# Altium schematic sheet QuarkNPi-Bata0.2-220731.schdoc
size 567 x 407 mm
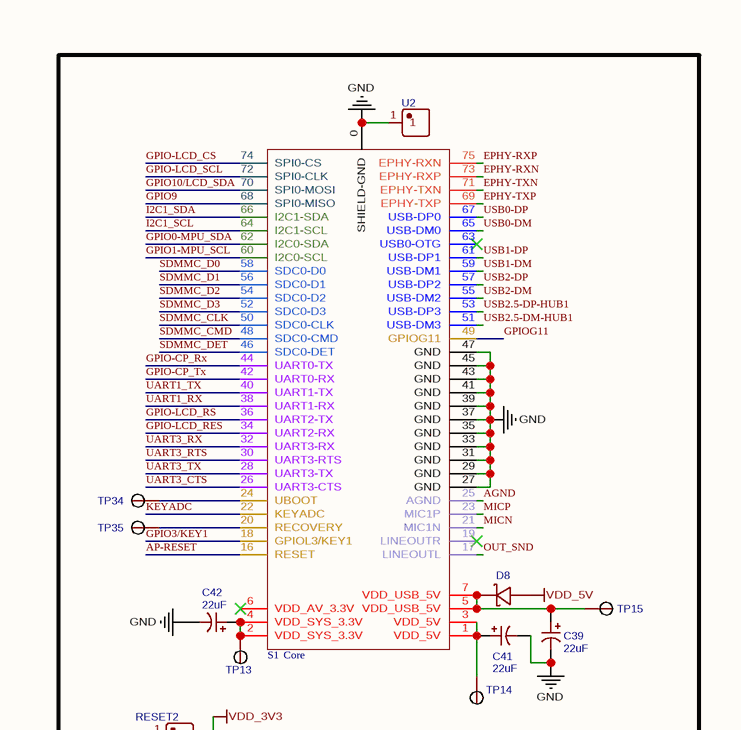
[diagram p0: QuarkNPi-Bata0.2-220731.schdoc, top left]
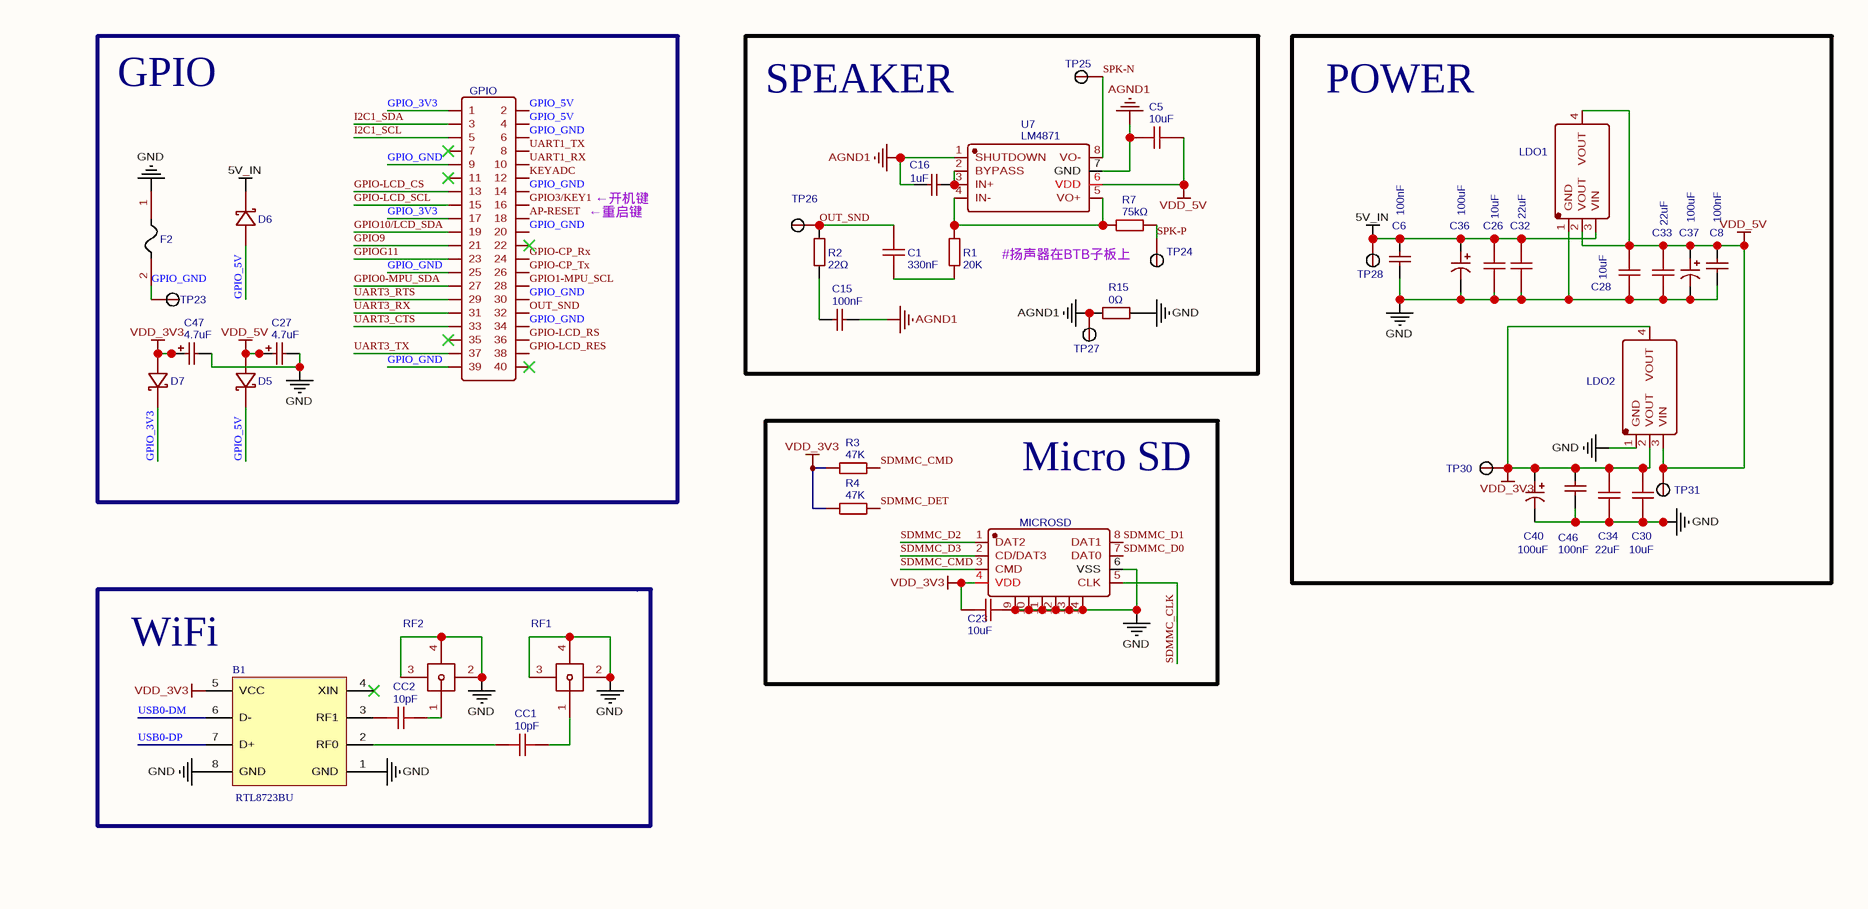
[diagram p1: QuarkNPi-Bata0.2-220731.schdoc, top right]
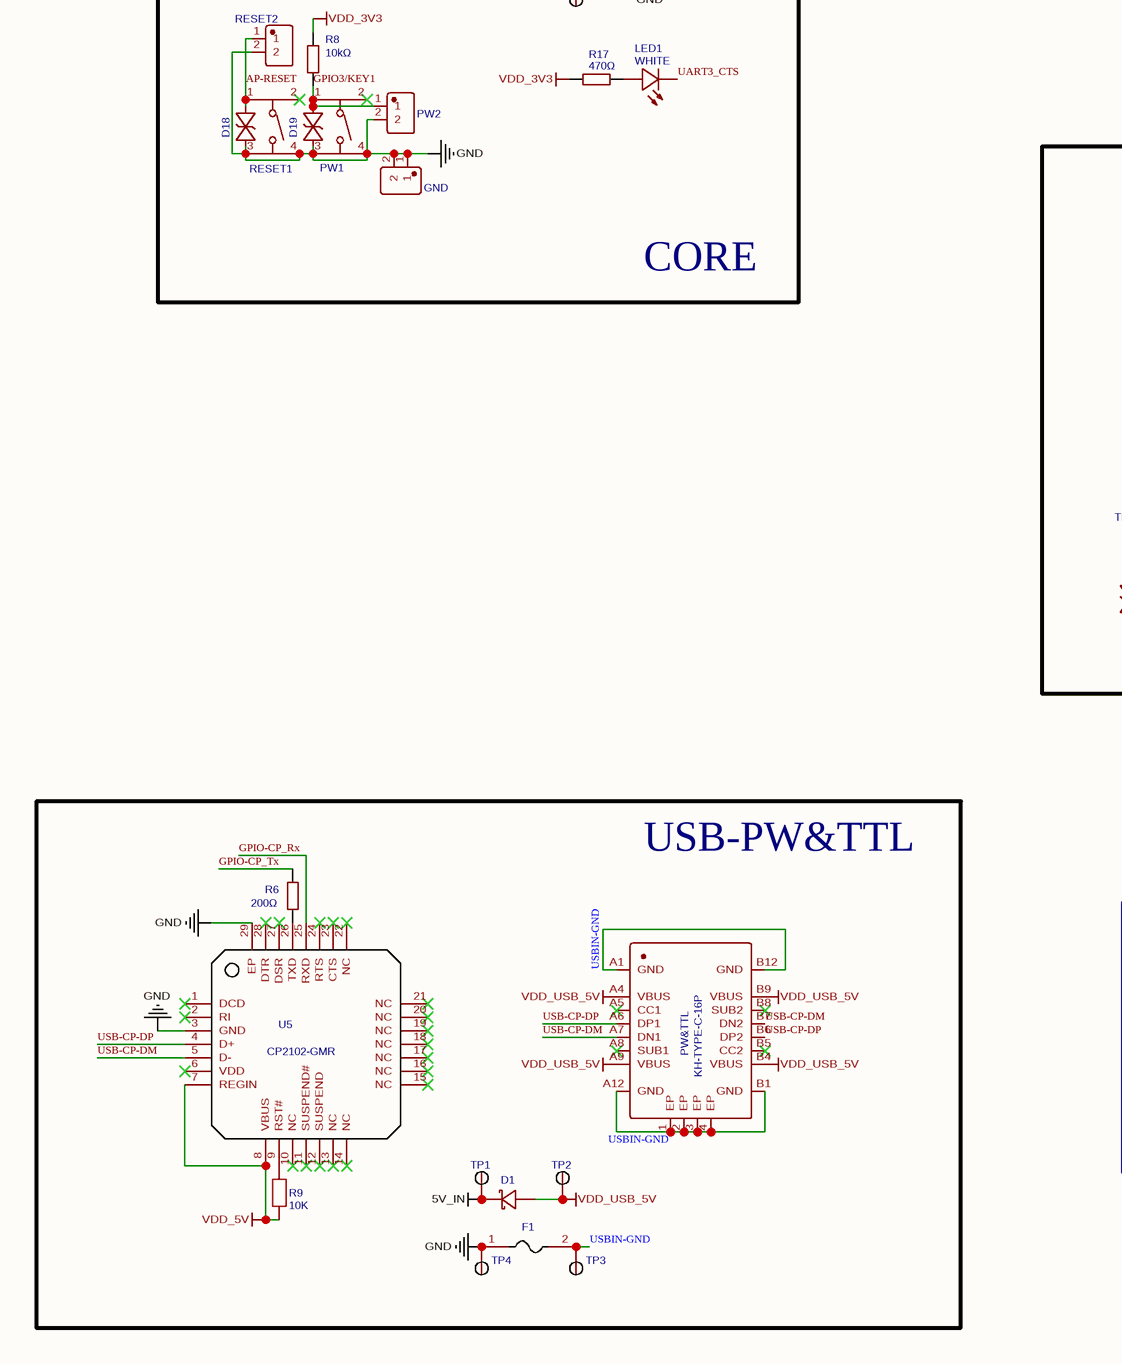
[diagram p2: QuarkNPi-Bata0.2-220731.schdoc, bottom left]
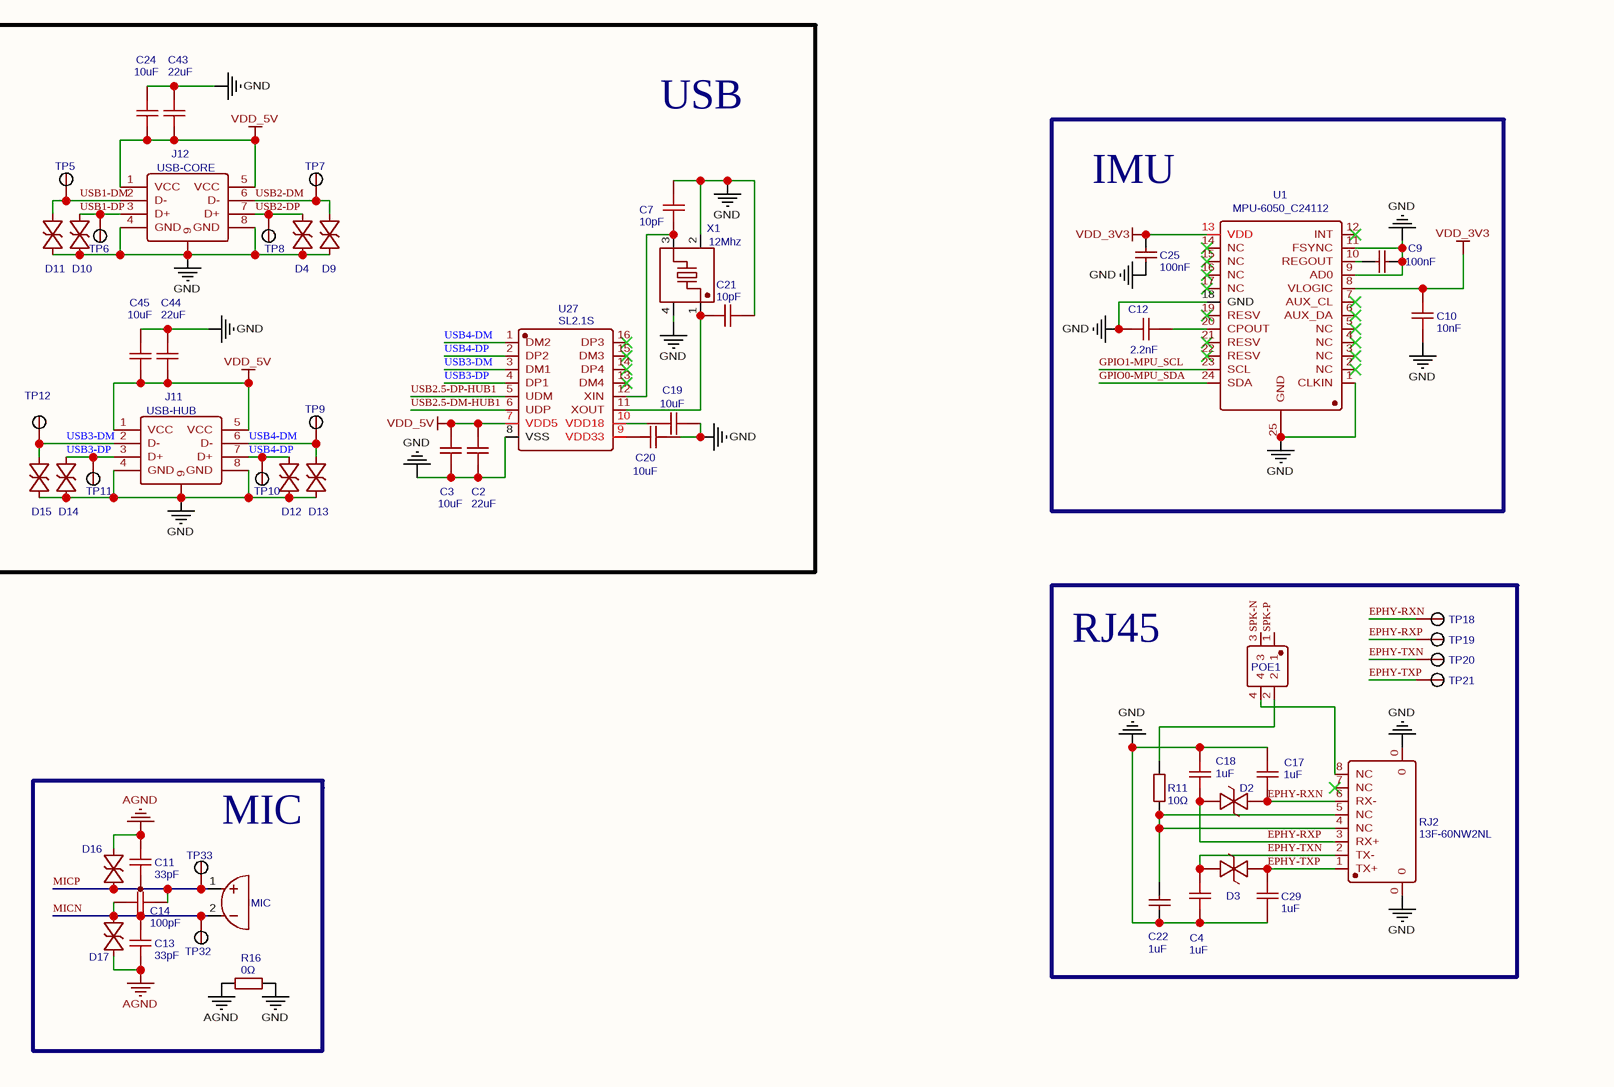
[diagram p3: QuarkNPi-Bata0.2-220731.schdoc, bottom right]

## Parts
B1  RTL8723BU  [USB-WIFI-BT-RTL8723BU]
C1  330nF  [C0402]
C2  22uF  [C0402]
C3  10uF  [C0402]
C4  1uF  [C0201]
C5  10uF  [C0402]
C6  100nF  [C0402_NEW]
C7  10pF  [C0402]
C8  100nF  [C0402_NEW]
C9  100nF  [C0402_NEW]
C10  10nF  [C0402]
C11  33pF  [C0201]
C12  2.2nF  [C0402]
C13  33pF  [C0201]
C14  100pF  [C0201]
C15  100nF  [C0402]
C16  1uF  [C0402]
C17  1uF  [C0201]
C18  1uF  [C0201]
C19  10uF  [C0603]
C20  10uF  [C0603]
C21  10pF  [C0402]
C22  1uF  [C0603]
C23  10uF  [C0402]
C24  10uF  [C0402]
C25  100nF  [C0402_NEW]
C26  10uF  [C0402]
C27  4.7uF  [CAP-SMD_L3.2-W1.6]
C28  10uF  [C0402]
C29  1uF  [C0201]
C30  10uF  [C0402]
C32  22uF  [C0402]
C33  22uF  [C0402]
C34  22uF  [C0402]
C36  100uF  [CAP-SMD_L3.2-W2.8-FD]
C37  100uF  [CAP-SMD_L3.2-W2.8-FD]
C39  22uF  [CAP-SMD_L2.0-W1.3-FD]
C40  100uF  [CAP-SMD_L3.2-W2.8-FD]
C41  22uF  [CAP-SMD_L2.0-W1.3-FD]
C42  22uF  [CAP-SMD_L2.0-W1.3-FD]
C43  22uF  [C0402]
C44  22uF  [C0402]
C45  10uF  [C0402]
C46  100nF  [C0402_NEW]
C47  4.7uF  [CAP-SMD_L3.2-W1.6]
CC1  10pF  [C0201]
CC2  10pF  [C0201]
D1  SS510G  [SMA_L4.4-W2.8-LS5.4-RD]  (value not drawn)
D2  EGA10201V05A0  [D0201-BI]  (value not drawn)
D3  EGA10201V05A0  [D0201-BI]  (value not drawn)
D4  ESD5451N-TP  [D0402-BI]  (value not drawn)
D5  SS510G  [SMA_L4.4-W2.8-LS5.4-RD]  (value not drawn)
D6  SS510G  [SMA_L4.4-W2.8-LS5.4-RD]  (value not drawn)
D7  SS510G  [SMA_L4.4-W2.8-LS5.4-RD]  (value not drawn)
D8  PMEG4030ER,115  [SOD-123_L2.6-W1.7-LS3.5-RD]  (value not drawn)
D9  ESD5451N-TP  [D0402-BI]  (value not drawn)
D10  ESD5451N-TP  [D0402-BI]  (value not drawn)
D11  ESD5451N-TP  [D0402-BI]  (value not drawn)
D12  ESD5451N-TP  [D0402-BI]  (value not drawn)
D13  ESD5451N-TP  [D0402-BI]  (value not drawn)
D14  ESD5451N-TP  [D0402-BI]  (value not drawn)
D15  ESD5451N-TP  [D0402-BI]  (value not drawn)
D16  ESD5451N-TP  [D0402-BI]  (value not drawn)
D17  ESD5451N-TP  [D0402-BI]  (value not drawn)
D18  ESD5451N-TP  [D0402-BI]  (value not drawn)
D19  ESD5451N-TP  [D0402-BI]  (value not drawn)
F1  mSMD400  [F1812]  (value not drawn)
F2  mSMD400  [F1812]  (value not drawn)
GND  KH-2.54PH180-1X2P-L11.5  [HDR-TH_2P-P2.54-V-M]  (value not drawn)
GPIO  Header-Male-2.54_2x20  [HDR-TH_40P-P2.54-V-M-R2-C20-S2.54]  (value not drawn)
J11  USB-HUB  [USB-A-TH_U-USBAR04P-F201]
J12  USB-CORE  [USB-A-TH_U-USBAR04P-F201]
LDO1  1117-5v  [SOT-223_L6.5-W3.5-P2.30-LS7.0-BR]  (value not drawn)
LDO2  1117-3V3  [SOT-223_L6.5-W3.5-P2.30-LS7.0-BR]  (value not drawn)
LED1  WHITE  [LED0402-RD_YELLOW]
MIC  GMI4013S-2C54DB  [MIC-SMD_BD4.0_B4013AM423-008]  (value not drawn)
MICROSD  1040310811  [SIM-SMD_8P-1040310811]  (value not drawn)
POE1  210-72-02GB01  [HDR-TH_4P-P2.54-V-R2-C2-S2.54_A2541WV-2X2P]  (value not drawn)
PW1  ST-1188  [SW-SMD_4P-L4.2-W3.2-P2.15-LS5.2]  (value not drawn)
PW2  KH-2.54PH180-1X2P-L11.5  [HDR-TH_2P-P2.54-V-M]  (value not drawn)
PW&TTL  KH-TYPE-C-16P  [USB-C-SMD_KH-TYPE-C-16P]
R1  20K  [R0402]
R2  22Ω  [R0402]
R3  47K  [R0402]
R4  47K  [R0402]
R6  200Ω  [R0402]
R7  75kΩ  [R0402]
R8  10kΩ  [R0402]
R9  10K  [R0402]
R11  10Ω  [R1206]
R15  0Ω  [R0402]
R16  0Ω  [R0402]
R17  470Ω  [R0402]
RESET1  ST-1188  [SW-SMD_4P-L4.2-W3.2-P2.15-LS5.2]  (value not drawn)
RESET2  KH-2.54PH180-1X2P-L11.5  [HDR-TH_2P-P2.54-V-M]  (value not drawn)
RF1  HC-RF-IPEX0303-01  [IPEX-SMD_HC-RF-IPEX0303-01]  (value not drawn)
RF2  HC-RF-IPEX0303-01  [IPEX-SMD_HC-RF-IPEX0303-01]  (value not drawn)
RJ2  13F-60NW2NL  [RJ45-TH_8P-P2.54-S2.54_L21.6-W16.3-EH11.4]
S1  Core  [QUANTUM-QUARK-N]
TP1  TP测试点  [TP测试点]  (value not drawn)
TP2  TP测试点  [TP测试点]  (value not drawn)
TP3  TP测试点  [TP测试点]  (value not drawn)
TP4  TP测试点  [TP测试点]  (value not drawn)
TP5  TP测试点  [TP测试点]  (value not drawn)
TP6  TP测试点  [TP测试点]  (value not drawn)
TP7  TP测试点  [TP测试点]  (value not drawn)
TP8  TP测试点  [TP测试点]  (value not drawn)
TP9  TP测试点  [TP测试点]  (value not drawn)
TP10  TP测试点  [TP测试点]  (value not drawn)
TP11  TP测试点  [TP测试点]  (value not drawn)
TP12  TP测试点  [TP测试点]  (value not drawn)
TP13  TP测试点  [TP测试点]  (value not drawn)
TP14  TP测试点  [TP测试点]  (value not drawn)
TP15  TP测试点  [TP测试点]  (value not drawn)
TP18  TP测试点  [TP测试点]  (value not drawn)
TP19  TP测试点  [TP测试点]  (value not drawn)
TP20  TP测试点  [TP测试点]  (value not drawn)
TP21  TP测试点  [TP测试点]  (value not drawn)
TP23  TP测试点  [TP测试点]  (value not drawn)
TP24  TP测试点  [TP测试点]  (value not drawn)
TP25  TP测试点  [TP测试点]  (value not drawn)
TP26  TP测试点  [TP测试点]  (value not drawn)
TP27  TP测试点  [TP测试点]  (value not drawn)
TP28  TP测试点  [TP测试点]  (value not drawn)
TP30  TP测试点  [TP测试点]  (value not drawn)
TP31  TP测试点  [TP测试点]  (value not drawn)
TP32  TP测试点  [TP测试点]  (value not drawn)
TP33  TP测试点  [TP测试点]  (value not drawn)
TP34  TP测试点  [TP测试点]  (value not drawn)
TP35  TP测试点  [TP测试点]  (value not drawn)
U1  MPU-6050_C24112  [QFN-24_L4.0-W4.0-P0.50-BL-EP2.7]
U2  SMTWE2015MTJ  [M.2螺孔]  (value not drawn)
U5  CP2102-GMR  [WQFN-28_L5.0-W5.0-P0.50-BL-EP3.2]
U7  LM4871  [SOP-8_L4.9-W3.9-P1.27-LS6.0-BL]
U27  SL2.1S  [SSOP-16_L4.6-W2.6-P0.53-LS4.0-BL]
X1  12Mhz  [OSC-SMD_4P-L2.5-W2.0-BL]

## Blocks framed on the sheet
GPIO: C27 C47 D5-D7 F2 GPIO TP23
SPEAKER: C1 C5 C15 C16 R1 R2 R7 R15 TP24-TP27 U7
POWER: C6 C8 C26 C28 C30 C32-C34 C36 C37 C40 C46 LDO1 LDO2 TP28 TP30 TP31
CORE: C39 C41 C42 D8 D18 D19 GND LED1 PW1 PW2 R8 R17 RESET1 RESET2 S1 TP13-TP15 TP34 TP35 U2
Micro SD: C23 MICROSD R3 R4
USB: C2 C3 C7 C19-C21 C24 C43-C45 D4 D9-D15 J11 J12 TP5-TP12 U27 X1
IMU: C9 C10 C12 C25 U1
RJ45: C4 C17 C18 C22 C29 D2 D3 POE1 R11 RJ2 TP18-TP21
USB-PW&TTL: D1 F1 PW&TTL R6 R9 TP1-TP4 U5

## Nets
5V_IN: C6.2 C26.2 C32.2 C36.1 D1.1(C) D6.1(C) LDO1.3(VIN) TP1.1 TP28.1
AGND: C11.2 C13.1 D16.2(A) D17.1(K) R16.1 S1.25(AGND)
AGND1: C5.2 C15.2 C16.1 R15.1 TP27.1 U7.1(SHUTDOWN) U7.7(GND)
GND: B1.1(GND) B1.8(GND) C2.1 C3.1 C4.1 C6.1 C7.2 C8.1 C9.1 C10.1 C12.1 C17.2 C18.2 C19.2 C20.2 C21.1 C22.1 C23.1 C24.2 C25.1 C26.1 C27.2 C28.1 C29.1 C30.1 C32.1 C33.1 C34.1 C36.2 C37.2 C39.2 C40.2 C41.2 C42.2 C43.2 C44.2 C45.2 C46.1 C47.2 D4.1(K) D9.1(K) D10.1(K) D11.1(K) D12.1(K) D13.1(K) D14.1(K) D15.1(K) D18.1(K) D19.1(K) F1.1 F2.1 GND.1 GND.2 J11.4(GND) J11.8(GND) J11.9 J12.4(GND) J12.8(GND) J12.9 LDO1.1(GND) LDO2.1(GND) MICROSD.6(VSS) MICROSD.9 MICROSD.10 MICROSD.11 MICROSD.12 MICROSD.13 MICROSD.14 PW1.3 PW1.4 PW2.2 R15.2 R16.2 RESET1.3 RESET1.4 RESET2.2 RF1.2 RF1.3 RF1.4 RF2.2 RF2.3 RF2.4 RJ2.0 S1.0(SHIELD-GND) S1.27(GND) S1.29(GND) S1.31(GND) S1.33(GND) S1.35(GND) S1.37(GND) S1.39(GND) S1.41(GND) S1.43(GND) S1.45(GND) S1.47(GND) TP4.1 U1.1(CLKIN) U1.9(AD0) U1.11(FSYNC) U1.18(GND) U1.25(GND) U2.1 U5.3(GND) U5.29(EP) U27.8(VSS) X1.2(GND) X1.4(GND)
VDD_3V3: B1.5(VCC) C10.2 C23.2 C25.2 C30.2 C34.2 C40.1 C46.2 C47.1 D7.2(A) LDO2.2(VOUT) LDO2.4(VOUT) MICROSD.4(VDD) R3.1 R4.1 R8.1 R17.1 TP30.1 U1.8(VLOGIC) U1.13(VDD)
VDD_5V: C2.2 C3.2 C5.1 C8.2 C24.1 C27.1 C28.2 C33.2 C37.1 C43.1 C44.1 C45.1 D5.2(A) D8.2(A) J11.1(VCC) J11.5(VCC) J12.1(VCC) J12.5(VCC) LDO1.2(VOUT) LDO1.4(VOUT) LDO2.3(VIN) R9.1 TP31.1 U5.7(REGIN) U5.8(VBUS) U7.6(VDD) U27.7(VDD5)
VDD_USB_5V: D1.2(A) PW&TTL.A4(VBUS) PW&TTL.A9(VBUS) PW&TTL.B4(VBUS) PW&TTL.B9(VBUS) TP2.1
AP-RESET: D18.2(A) GPIO.18 RESET1.1 RESET2.1 S1.16(RESET)
EPHY-RXN: C17.1 D2.2 RJ2.6(RX-) S1.73(EPHY-RXP) TP18.1
EPHY-RXP: C18.1 D2.1 RJ2.3(RX+) S1.75(EPHY-RXN) TP19.1
EPHY-TXN: C4.2 D3.1 RJ2.2(TX-) S1.71(EPHY-TXN) TP20.1
EPHY-TXP: C29.2 D3.2 RJ2.1(TX+) S1.69(EPHY-TXP) TP21.1
GPIO0-MPU_SDA: GPIO.27 S1.62(I2C0-SDA) U1.24(SDA)
GPIO1-MPU_SCL: GPIO.28 S1.60(I2C0-SCL) U1.23(SCL)
GPIO3/KEY1: D19.2(A) GPIO.16 PW1.1 PW2.1 R8.2 S1.18(GPIOL3/KEY1)
GPIO9: GPIO.21 S1.68(SPI0-MISO)
GPIO10/LCD_SDA: GPIO.19 S1.70(SPI0-MOSI)
GPIO-CP_Rx: GPIO.24 S1.44(UART0-TX) U5.25(RXD)
GPIO-CP_Tx: GPIO.26 R6.2 S1.42(UART0-RX)
GPIO-LCD_CS: GPIO.13 S1.74(SPI0-CS)
GPIO-LCD_RES: GPIO.38 S1.34(UART2-RX)
GPIO-LCD_RS: GPIO.36 S1.36(UART2-TX)
GPIO-LCD_SCL: GPIO.15 S1.72(SPI0-CLK)
GPIO_3V3: D7.1(C) GPIO.1 GPIO.17
GPIO_5V: D5.1(C) D6.2(A) GPIO.2 GPIO.4
GPIO_GND: F2.2 GPIO.6 GPIO.9 GPIO.14 GPIO.20 GPIO.25 GPIO.30 GPIO.34 GPIO.39 TP23.1
GPIOG11: GPIO.23 S1.49(GPIOG11)
I2C1_SCL: GPIO.5 S1.64(I2C1-SCL)
I2C1_SDA: GPIO.3 S1.66(I2C1-SDA)
KEYADC: GPIO.12 S1.22(KEYADC)
MICN: C13.2 C14.1 D17.2(A) MIC.2 S1.21(MIC1N) TP32.1
MICP: C11.1 C14.2 D16.1(K) MIC.1 S1.23(MIC1P) TP33.1
OUT_SND: C1.1 GPIO.32 R2.2 S1.17(LINEOUTL) TP26.1
SDMMC_CLK: MICROSD.5(CLK) S1.50(SDC0-CLK)
SDMMC_CMD: MICROSD.3(CMD) R3.2 S1.48(SDC0-CMD)
SDMMC_D0: MICROSD.7(DAT0) S1.58(SDC0-D0)
SDMMC_D1: MICROSD.8(DAT1) S1.56(SDC0-D1)
SDMMC_D2: MICROSD.1(DAT2) S1.54(SDC0-D2)
SDMMC_D3: MICROSD.2(CD/DAT3) S1.52(SDC0-D3)
SDMMC_DET: R4.2 S1.46(SDC0-DET)
SPK-N: POE1.3 TP25.1 U7.8(VO-)
SPK-P: POE1.1 R7.2 TP24.1
UART1_RX: GPIO.10 S1.38(UART1-RX)
UART1_TX: GPIO.8 S1.40(UART1-TX)
UART3_CTS: GPIO.33 LED1.1(K) S1.26(UART3-CTS)
UART3_RTS: GPIO.29 S1.30(UART3-RTS)
UART3_RX: GPIO.31 S1.32(UART3-RX)
UART3_TX: GPIO.37 S1.28(UART3-TX)
USB0-DM: B1.6(D-) S1.65(USB-DM0)
USB0-DP: B1.7(D+) S1.67(USB-DP0)
USB1-DM: D11.2(A) J12.2(D-) S1.59(USB-DM1) TP5.1
USB1-DP: D10.2(A) J12.3(D+) S1.61(USB-DP1) TP6.1
USB2-DM: D9.2(A) J12.6(D-) S1.55(USB-DM2) TP7.1
USB2-DP: D4.2(A) J12.7(D+) S1.57(USB-DP2) TP8.1
USB2.5-DM-HUB1: S1.51(USB-DM3) U27.6(UDP)
USB2.5-DP-HUB1: S1.53(USB-DP3) U27.5(UDM)
USB3-DM: D15.2(A) J11.2(D-) TP12.1 U27.3(DM1)
USB3-DP: D14.2(A) J11.3(D+) TP11.1 U27.4(DP1)
USB4-DM: D13.2(A) J11.6(D-) TP9.1 U27.1(DM2)
USB4-DP: D12.2(A) J11.7(D+) TP10.1 U27.2(DP2)
USB-CP-DM: PW&TTL.A7(DN1) PW&TTL.B7(DN2) U5.5(D-)
USB-CP-DP: PW&TTL.A6(DP1) PW&TTL.B6(DP2) U5.4(D+)
USBIN-GND: F1.2 PW&TTL.1(EP) PW&TTL.2(EP) PW&TTL.3(EP) PW&TTL.4(EP) PW&TTL.A1(GND) PW&TTL.A12(GND) PW&TTL.B1(GND) PW&TTL.B12(GND) TP3.1
NetB1_2: B1.2(RF0) CC1.1
NetB1_3: B1.3(RF1) CC2.1
NetC1_2: C1.2 R1.1
NetC7_1: C7.1 U27.12(XIN) X1.3
NetC9_2: C9.2 U1.10(REGOUT)
NetC12_2: C12.2 U1.20(CPOUT)
NetC15_1: C15.1 R2.1
NetC16_2: C16.2 U7.2(BYPASS) U7.3(IN+)
NetC19_1: C19.1 U27.10(VDD18)
NetC20_1: C20.1 U27.9(VDD33)
NetC21_2: C21.2 U27.11(XOUT) X1.1
NetC22_2: C22.2 R11.1 RJ2.4(NC) RJ2.5(NC)
NetC39_1: C39.1 D8.1(K) S1.5(VDD_USB_5V) S1.7(VDD_USB_5V) TP15.1
NetC41_1: C41.1 S1.1(VDD_5V) S1.3(VDD_5V) TP14.1
NetC42_1: C42.1 S1.2(VDD_SYS_3.3V) S1.4(VDD_SYS_3.3V) TP13.1
NetCC1_2: CC1.2 RF1.1
NetCC2_2: CC2.2 RF2.1
NetLED1_2: LED1.2(A) R17.2
NetPOE1_2: POE1.2 R11.2
NetPOE1_4: POE1.4 RJ2.8(NC)
NetR1_2: R1.2 R7.1 U7.4(IN-) U7.5(VO+)
NetR6_1: R6.1 U5.26(TXD)
NetR9_2: R9.2 U5.9(RST#)
NetS1_20: S1.20(RECOVERY) TP35.1
NetS1_24: S1.24(UBOOT) TP34.1

Not connected (* = marked no-connect by the designer): B1 4(XIN)*; GPIO 7* 11* 22* 35* 40*; PW1 2*; PW&TTL A5(CC1)* A8(SUB1)* B5(CC2)* B8(SUB2)*; RESET1 2*; RJ2 7(NC)*; S1 6(VDD_AV_3.3V)* 19(LINEOUTR)* 63(USB0-OTG)*; U1 2(NC)* 3(NC)* 4(NC)* 5(NC)* 6(AUX_DA)* 7(AUX_CL)* 12(INT)* 14(NC)* 15(NC)* 16(NC)* 17(NC)* 19(RESV)* 21(RESV)* 22(RESV)*; U5 1(DCD)* 2(RI)* 6(VDD)* 10(NC)* 11(SUSPEND#)* 12(SUSPEND)* 13(NC)* 14(NC)* 15(NC)* 16(NC)* 17(NC)* 18(NC)* 19(NC)* 20(NC)* 21(NC)* 22(NC)* 23(CTS)* 24(RTS)* 27(DSR)* 28(DTR)*; U27 13(DM4)* 14(DP4)* 15(DM3)* 16(DP3)*

## Notes on the sheet
- ←重启键
- ←开机键
- #扬声器在BTB子板上
- (near B1) WiFi
- MIC

## Library data of the parts
B1 = RTL8723BU: BOM_Manufacturer: REALTEK(瑞昱); BOM_Manufacturer Part: RTL8723DU-CG; BOM_Supplier Part: C2760483; BOM_Supplier: LCSC
C1 = 330nF: BOM_Manufacturer: Samsung Electro-Mechanics; BOM_Manufacturer Part: CL05A334KP5NNNC; nameAlias: Capacitance; Contributor: LCSC; BOM_Supplier: LCSC; BOM_Supplier Part: C318569; BOM_JLCPCB Part Class: Extended Part; spicePre: C; spiceSymbolName: CL05A334KP5NNNC
C2 C32-C34 C43 C44 = 22uF: BOM_Manufacturer: muRata(村田); BOM_Manufacturer Part: GRM155C80E226ME11D; nameAlias: Capacitance; Contributor: lcsc; BOM_Supplier: LCSC; BOM_Supplier Part: C907955; link: https://atta.szlcsc.com/upload/public/pdf/source/20201022/C907955_79F1087AF1B052483A944DF68DC1C10F.pdf; BOM_JLCPCB Part Class: Extended Part; spicePre: C; spiceSymbolName: GRM155C80E226ME11D
C3 C23 C24 C26 C28 C30 C45 = 10uF: BOM_Manufacturer: muRata(村田); BOM_Manufacturer Part: ZRB15XR61A106ME01D; nameAlias: Capacitance; Contributor: LCSC; BOM_Supplier: LCSC; BOM_Supplier Part: C527590; BOM_JLCPCB Part Class: Extended Part; spicePre: C; spiceSymbolName: ZRB15XR61A106ME01D
C4 C17 C18 C29 = 1uF: BOM_Manufacturer: TAIYO YUDEN(太诱); BOM_Manufacturer Part: JMK063BC6105MP-F; nameAlias: Capacitance; Contributor: lcsc; BOM_Supplier: LCSC; BOM_Supplier Part: C697613; BOM_JLCPCB Part Class: Extended Part; spicePre: C; spiceSymbolName: JMK063BC6105MP-F
C5 = 10uF: BOM_Manufacturer: muRata(村田); BOM_Manufacturer Part: GRJ155R60J106ME11D; nameAlias: Capacitance; Contributor: lcsc; BOM_Supplier: LCSC; BOM_Supplier Part: C469527; link: https://atta.szlcsc.com/upload/public/pdf/source/20191220/C469527_E196AAF1AD50AACDA035CC5E3D7EDBEE.pdf; BOM_JLCPCB Part Class: Extended Part; spicePre: C; spiceSymbolName: GRJ155R60J106ME11D
C6 C8 C9 C25 C46 = 100nF: BOM_Manufacturer Part: CL05B104KO5NNNC; BOM_Manufacturer: SAMSUNG; nameAlias: Capacitance; BOM_Supplier: LCSC; BOM_Supplier Part: C1525; BOM_JLCPCB Part Class: Basic Part; spicePre: C; spiceSymbolName: CL05B104KO5NNNC
C7 C21 = 10pF: BOM_Manufacturer: TDK; BOM_Manufacturer Part: CGA2B2NP01H100DT0Y0F; Contributor: LCSC; nameAlias: Capacitance; BOM_Supplier: LCSC; BOM_Supplier Part: C694492; BOM_JLCPCB Part Class: Extended Part; spicePre: C; spiceSymbolName: CGA2B2NP01H100DT0Y0F
C10 = 10nF: BOM_Manufacturer: muRata(村田); BOM_Manufacturer Part: GRM155R71E103JA01D; nameAlias: Capacitance; Contributor: LCSC; BOM_Supplier: LCSC; BOM_Supplier Part: C576461; BOM_JLCPCB Part Class: Extended Part; spicePre: C; spiceSymbolName: GRM155R71E103JA01D
C11 C13 = 33pF: BOM_Manufacturer: Murata Electronics; BOM_Manufacturer Part: GRM0335C1H330GA01D; nameAlias: Capacitance; Contributor: LCSC; BOM_Supplier: LCSC; BOM_Supplier Part: C237536; spicePre: C; spiceSymbolName: GRM0335C1H330GA01D
C12 = 2.2nF: BOM_Manufacturer: muRata(村田); BOM_Manufacturer Part: GRM155R71C222KA01D; nameAlias: Capacitance; Contributor: LCSC; BOM_Supplier: LCSC; BOM_Supplier Part: C701316; BOM_JLCPCB Part Class: Extended Part; spicePre: C; spiceSymbolName: GRM155R71C222KA01D
C14 = 100pF: BOM_Manufacturer: Murata Electronics; BOM_Manufacturer Part: GRM0335C1E101FA01D; nameAlias: Capacitance; Contributor: LCSC; BOM_Supplier: LCSC; BOM_Supplier Part: C527989; spicePre: C; spiceSymbolName: GRM0335C1E101FA01D
C15 = 100nF: BOM_Manufacturer: FH; BOM_Manufacturer Part: 0402F104M500NT; nameAlias: Capacitance; BOM_Supplier: LCSC; BOM_Supplier Part: C1581; BOM_JLCPCB Part Class: Extended Part; spicePre: C; spiceSymbolName: 0402F104M500NT
C16 = 1uF: BOM_Manufacturer: FH; BOM_Manufacturer Part: 0402B105K100NT; nameAlias: Capacitance; BOM_Supplier: LCSC; BOM_Supplier Part: C1526; BOM_JLCPCB Part Class: Extended Part; spicePre: C; spiceSymbolName: 0402B105K100NT
C19 C20 = 10uF: BOM_Manufacturer Part: LMK107BJ106MALTD; BOM_Manufacturer: TAIYO YUDEN; nameAlias: Value(F); Contributor: LCEDA_Lib; BOM_Supplier Part: C18800; BOM_Supplier: LCSC; spicePre: C; spiceSymbolName: C_0603_US
C22 = 1uF: BOM_Manufacturer: FH; BOM_Manufacturer Part: 0603F105M160NT; nameAlias: Capacitance; BOM_Supplier: LCSC; BOM_Supplier Part: C1689; BOM_JLCPCB Part Class: Extended Part; spicePre: C; spiceSymbolName: 0603F105M160NT
C27 C47 = 4.7uF: BOM_Manufacturer: AVX; BOM_Manufacturer Part: TAJA475K016RNJ; nameAlias: Capacitance; BOM_Supplier: LCSC; BOM_Supplier Part: C7187; BOM_JLCPCB Part Class: Extended Part; spicePre: C; spiceSymbolName: TAJA475K016RNJ
C36 C37 C40 = 100uF: BOM_Manufacturer: CEC(振华新云); BOM_Manufacturer Part: CA45A-B-10V-100UF-M; Contributor: lcsc; BOM_Supplier: LCSC; BOM_Supplier Part: C2976907; BOM_JLCPCB Part Class: Extended Part; spicePre: C; spiceSymbolName: CA45A-B-10V-100UF-M
C39 C41 C42 = 22uF: BOM_Manufacturer: ROHM(罗姆); BOM_Manufacturer Part: TCTP1A226M8R; nameAlias: Capacitance; Contributor: LCSC; BOM_Supplier: LCSC; BOM_Supplier Part: C2859526; BOM_JLCPCB Part Class: Extended Part; spicePre: C; spiceSymbolName: TCTP1A226M8R
CC1 CC2 = 10pF: BOM_Manufacturer: SAMSUNG(三星); BOM_Manufacturer Part: CL03C100DA3GNNC; nameAlias: Capacitance; Contributor: LCSC; BOM_Supplier: LCSC; BOM_Supplier Part: C2762285; spicePre: C; spiceSymbolName: CL03C100DA3GNNC
D1 D5-D7 = SS510G: BOM_Manufacturer: Shikues; Contributor: LCSC; BOM_Supplier: LCSC; BOM_Supplier Part: C719153; BOM_Manufacturer Part: SS510G; BOM_JLCPCB Part Class: Extended Part; spicePre: D; spiceSymbolName: SS510G
D2 D3 = EGA10201V05A0: BOM_Manufacturer: INPAQ; Contributor: LCSC; BOM_Supplier: LCSC; BOM_Supplier Part: C693037; BOM_Manufacturer Part: EGA10201V05A0; spicePre: D; spiceSymbolName: EGA10201V05A0
D4 D9-D19 = ESD5451N-TP: BOM_Manufacturer: TECH PUBLIC(台舟电子); Contributor: LCSC; BOM_Supplier: LCSC; BOM_Supplier Part: C2830311; BOM_Manufacturer Part: ESD5451N-TP; BOM_JLCPCB Part Class: Extended Part; spicePre: D; spiceSymbolName: ESD5451N-TP
D8 = PMEG4030ER,115: BOM_Manufacturer: Nexperia; Contributor: LCSC; BOM_Supplier: LCSC; BOM_Supplier Part: C389355; BOM_Manufacturer Part: PMEG4030ER,115; BOM_JLCPCB Part Class: Extended Part; spicePre: D; spiceSymbolName: PMEG4030ER,115
F1 F2 = mSMD400: BOM_Manufacturer: TECHFUSE; BOM_Supplier: LCSC; BOM_Manufacturer Part: mSMD400; BOM_Supplier Part: C70132; BOM_JLCPCB Part Class: Extended Part; spicePre: F; spiceSymbolName: mSMD400
GND PW2 RESET2 = KH-2.54PH180-1X2P-L11.5: BOM_Manufacturer: kinghelm(金航标); Contributor: LCSC; BOM_Supplier: LCSC; BOM_Supplier Part: C2905434; BOM_Manufacturer Part: KH-2.54PH180-1X2P-L11.5; BOM_JLCPCB Part Class: Extended Part; spicePre: H; spiceSymbolName: KH-2.54PH180-1X2P-L11.5
GPIO = Header-Male-2.54_2x20: BOM_Manufacturer: ReliaPro; BOM_Supplier: LCSC; BOM_Manufacturer Part: Header-Male-2.54_2x20; BOM_Supplier Part: C50980; BOM_JLCPCB Part Class: Extended Part; spicePre: H; spiceSymbolName: Header-Male-2.54_2x20
J11 = USB-HUB: BOM_Manufacturer: Shenzhen Cankemeng; BOM_Manufacturer Part: U-USBAR04P-F201; Contributor: LCSC; BOM_Supplier: LCSC; BOM_Supplier Part: C386741; BOM_JLCPCB Part Class: Extended Part; spicePre: U; spiceSymbolName: U-USBAR04P-F201
J12 = USB-CORE: BOM_Manufacturer: Shenzhen Cankemeng; BOM_Manufacturer Part: U-USBAR04P-F201; Contributor: LCSC; BOM_Supplier: LCSC; BOM_Supplier Part: C386741; BOM_JLCPCB Part Class: Extended Part; spicePre: U; spiceSymbolName: U-USBAR04P-F201
LDO1 = 1117-5v: BOM_Manufacturer: PUOLOP; BOM_Manufacturer Part: AMS1117-5.0; Contributor: LCSC; BOM_Supplier: LCSC; BOM_Supplier Part: C351787; BOM_JLCPCB Part Class: Extended Part; spicePre: U; spiceSymbolName: AMS1117-5.0_C351787
LDO2 = 1117-3V3: BOM_Manufacturer: PUOLOP; BOM_Manufacturer Part: AMS1117-5.0; Contributor: LCSC; BOM_Supplier: LCSC; BOM_Supplier Part: C351787; BOM_JLCPCB Part Class: Extended Part; spicePre: U; spiceSymbolName: AMS1117-5.0_C351787
LED1 = WHITE: BOM_Manufacturer: MEIHUA; BOM_Manufacturer Part: MHT136CYCT; Contributor: LCSC; BOM_Supplier: LCSC; BOM_Supplier Part: C401110; BOM_JLCPCB Part Class: Extended Part; spicePre: L; spiceSymbolName: MHT136CYCT
MIC = GMI4013S-2C54DB: BOM_Manufacturer: INGHAi; Contributor: LCSC; BOM_Supplier: LCSC; BOM_Supplier Part: C529868; BOM_Manufacturer Part: GMI4013S-2C54DB; BOM_JLCPCB Part Class: Extended Part; spicePre: M; spiceSymbolName: GMI4013S-2C54DB
MICROSD = 1040310811: BOM_Manufacturer: MOLEX; Contributor: LCSC; BOM_Supplier: LCSC; BOM_Supplier Part: C585350; BOM_Manufacturer Part: 1040310811; BOM_JLCPCB Part Class: Extended Part; spicePre: S; spiceSymbolName: 1040310811
POE1 = 210-72-02GB01: BOM_Manufacturer: PINREX; Contributor: LCSC; BOM_Supplier: LCSC; BOM_Supplier Part: C402780; BOM_Manufacturer Part: 210-72-02GB01; BOM_JLCPCB Part Class: Extended Part; spicePre: H; spiceSymbolName: 210-72-02GB01
PW1 RESET1 = ST-1188: BOM_Manufacturer: RI SHENG; Contributor: LCSC; BOM_Supplier: LCSC; BOM_Supplier Part: C589212; BOM_Manufacturer Part: ST-1188; BOM_JLCPCB Part Class: Extended Part; spicePre: S; spiceSymbolName: ST-1188
PW&TTL = KH-TYPE-C-16P: BOM_Manufacturer: Shenzhen Kinghelm Elec; Contributor: LCSC; BOM_Supplier: LCSC; BOM_Supplier Part: C709357; BOM_Manufacturer Part: KH-TYPE-C-16P; BOM_JLCPCB Part Class: Extended Part; spicePre: U; spiceSymbolName: KH-TYPE-C-16P
R1 = 20K: BOM_Manufacturer: YAGEO; BOM_Manufacturer Part: AC0402FR-0720KL; nameAlias: Resistance (Ohms); Contributor: LCSC; Resistance: 20kΩ; BOM_Supplier: LCSC; BOM_Supplier Part: C144783; BOM_JLCPCB Part Class: Extended Part; spicePre: R; spiceSymbolName: AC0402FR-0720KL
R2 = 22Ω: BOM_Manufacturer: LIZ; BOM_Manufacturer Part: CR0402FF22R0G; nameAlias: Resistance; Resistance (Ohms): 22; BOM_Supplier: LCSC; BOM_Supplier Part: C100318; BOM_JLCPCB Part Class: Extended Part; spicePre: R; spiceSymbolName: CR0402FF22R0G
R3 R4 = 47K: BOM_Manufacturer: BOURNS; BOM_Manufacturer Part: CR0402-JW-473GLF; nameAlias: Resistance (Ohms); Contributor: LCSC; Resistance: 47kΩ; BOM_Supplier: LCSC; BOM_Supplier Part: C203176; BOM_JLCPCB Part Class: Extended Part; JLCPCB Part Class: Extended Part; spicePre: R; spiceSymbolName: CR0402-JW-473GLF
R6 = 200Ω: BOM_Manufacturer: UniOhm; BOM_Manufacturer Part: 0402WGJ0201TCE; nameAlias: Resistance; Resistance (Ohms): 200; BOM_Supplier: LCSC; BOM_Supplier Part: C25149; BOM_JLCPCB Part Class: Extended Part; spicePre: R; spiceSymbolName: 0402WGJ0201TCE
R7 = 75kΩ: BOM_Manufacturer: Stackpole Elec; BOM_Manufacturer Part: RMCF0402FT75K0; Resistance (Ohms): 75K; nameAlias: Resistance; Contributor: LCSC; BOM_Supplier: LCSC; BOM_Supplier Part: C237746; BOM_JLCPCB Part Class: Extended Part; spicePre: R; spiceSymbolName: RMCF0402FT75K0
R8 = 10kΩ: BOM_Manufacturer: RALEC; BOM_Manufacturer Part: RTT02103JTH; nameAlias: Resistance; Resistance (Ohms): 10K; BOM_Supplier: LCSC; BOM_Supplier Part: C102759; BOM_JLCPCB Part Class: Extended Part; spicePre: R; spiceSymbolName: RTT02103JTH
R9 = 10K: BOM_Manufacturer: VO(翔胜); BOM_Manufacturer Part: SCR0402J10K; Contributor: lcsc; BOM_Supplier: LCSC; BOM_Supplier Part: C3017497; spicePre: R; spiceSymbolName: SCR0402J10K
R11 = 10Ω: BOM_Manufacturer: LIZ; BOM_Manufacturer Part: CR1206J40100G; nameAlias: Resistance; Resistance (Ohms): 10; BOM_Supplier: LCSC; BOM_Supplier Part: C102266; BOM_JLCPCB Part Class: Extended Part; spicePre: R; spiceSymbolName: CR1206J40100G
R15 R16 = 0Ω: BOM_Manufacturer: KOA; BOM_Manufacturer Part: RK73Z1ETTP; nameAlias: Resistance; Resistance (Ohms): 0; BOM_Supplier: LCSC; BOM_Supplier Part: C131359; BOM_JLCPCB Part Class: Extended Part; spicePre: R; spiceSymbolName: RK73Z1ETTP
R17 = 470Ω: BOM_Manufacturer: LIZ; BOM_Manufacturer Part: CR0402FF4700G; nameAlias: Resistance; Resistance (Ohms): 470; BOM_Supplier: LCSC; BOM_Supplier Part: C100443; BOM_JLCPCB Part Class: Extended Part; spicePre: R; spiceSymbolName: CR0402FF4700G
RF1 RF2 = HC-RF-IPEX0303-01: BOM_Manufacturer: HCTL(华灿天禄); Contributor: LCSC; BOM_Supplier: LCSC; BOM_Supplier Part: C2894919; BOM_Manufacturer Part: HC-RF-IPEX0303-01; BOM_JLCPCB Part Class: Extended Part; spicePre: R; spiceSymbolName: HC-RF-IPEX0303-01
RJ2 = 13F-60NW2NL: BOM_Manufacturer: YDS; Contributor: LCSC; BOM_Supplier: LCSC; BOM_Supplier Part: C284737; BOM_Manufacturer Part: 13F-60NW2NL; BOM_JLCPCB Part Class: Extended Part; spicePre: R; spiceSymbolName: 13F-60NW2NL
S1 = Core: BOM_Manufacturer: FOXCONN(富士康); BOM_Manufacturer Part: AS0BC21-S30BA-7H; BOM_Supplier: LCSC; BOM_Supplier Part: C2761343
TP1-TP15 TP18-TP21 TP23-TP28 TP30-TP35 = TP测试点: Contributor: Hannibalhz; spicePre: T; spiceSymbolName: TP测试点
U1 = MPU-6050_C24112: BOM_Manufacturer: InvenSense; sourceId: 1T5FDZYC8; timeStamp: 1462265206; BOM_Supplier: LCSC; BOM_Manufacturer Part: MPU-6050; BOM_Supplier Part: C24112; BOM_JLCPCB Part Class: Basic Part; spicePre: U; spiceSymbolName: MPU-6050_C24112
U2 = SMTWE2015MTJ: BOM_Manufacturer: Sinhoo(雄和远景); Contributor: lcsc; BOM_Supplier: LCSC; BOM_Supplier Part: C2928176; BOM_Manufacturer Part: SMTWE2015MTJ; BOM_JLCPCB Part Class: Extended Part; spicePre: U; spiceSymbolName: SMTWE2015MTJ
U5 = CP2102-GMR: BOM_Manufacturer: SILICON LABS; BOM_Supplier: LCSC; BOM_Manufacturer Part: CP2102-GMR; BOM_Supplier Part: C6568; BOM_JLCPCB Part Class: Basic Part; spicePre: U; spiceSymbolName: CP2102-GMR
U7 = LM4871: BOM_Manufacturer: LTKCHIP; Contributor: LCSC; BOM_Supplier: LCSC; BOM_Supplier Part: C406250; BOM_Manufacturer Part: LM4871; BOM_JLCPCB Part Class: Extended Part; spicePre: U; spiceSymbolName: LM4871
U27 = SL2.1S: BOM_Manufacturer: CoreChips(和芯润德); Contributor: LCSC; BOM_Supplier: LCSC; BOM_Supplier Part: C2684433; BOM_Manufacturer Part: SL2.1s; BOM_JLCPCB Part Class: Extended Part; spicePre: U; spiceSymbolName: SL2.1S
X1 = 12Mhz: BOM_Manufacturer: TAITIEN Elec; BOM_Manufacturer Part: XYDBPCNANF-12MHZ; nameAlias: Frequency; Contributor: LCSC; BOM_Supplier: LCSC; BOM_Supplier Part: C521567; BOM_JLCPCB Part Class: Extended Part; spicePre: X; spiceSymbolName: XYDBPCNANF-12MHZ